# Altium schematic sheet 01. TABLE OF CONTENTS.SchDoc: TABLE OF CONTENTS
size 513 x 386 mm; Page Create Date: March  8, 1995; Variant Name: Core Design; Page Number: 1; Schematic Page Number: 1; Page Size: C; Comment: MISTRAL_TITLEBLK_CSIZE_1; Page Count: 62; Project: PROC154E2(001)_SK_AM69; Issue: 1.0; RevCode: E3; DsnPath: C:\Users\danie\Downloads\sprr466c\PROC154E3_RP\PROC154E3_SCH.DSN; SchematicName: SCHEMATIC1; PageName: 01. TABLE OF CONTENTS; PageSize: C; TopSchematic: True
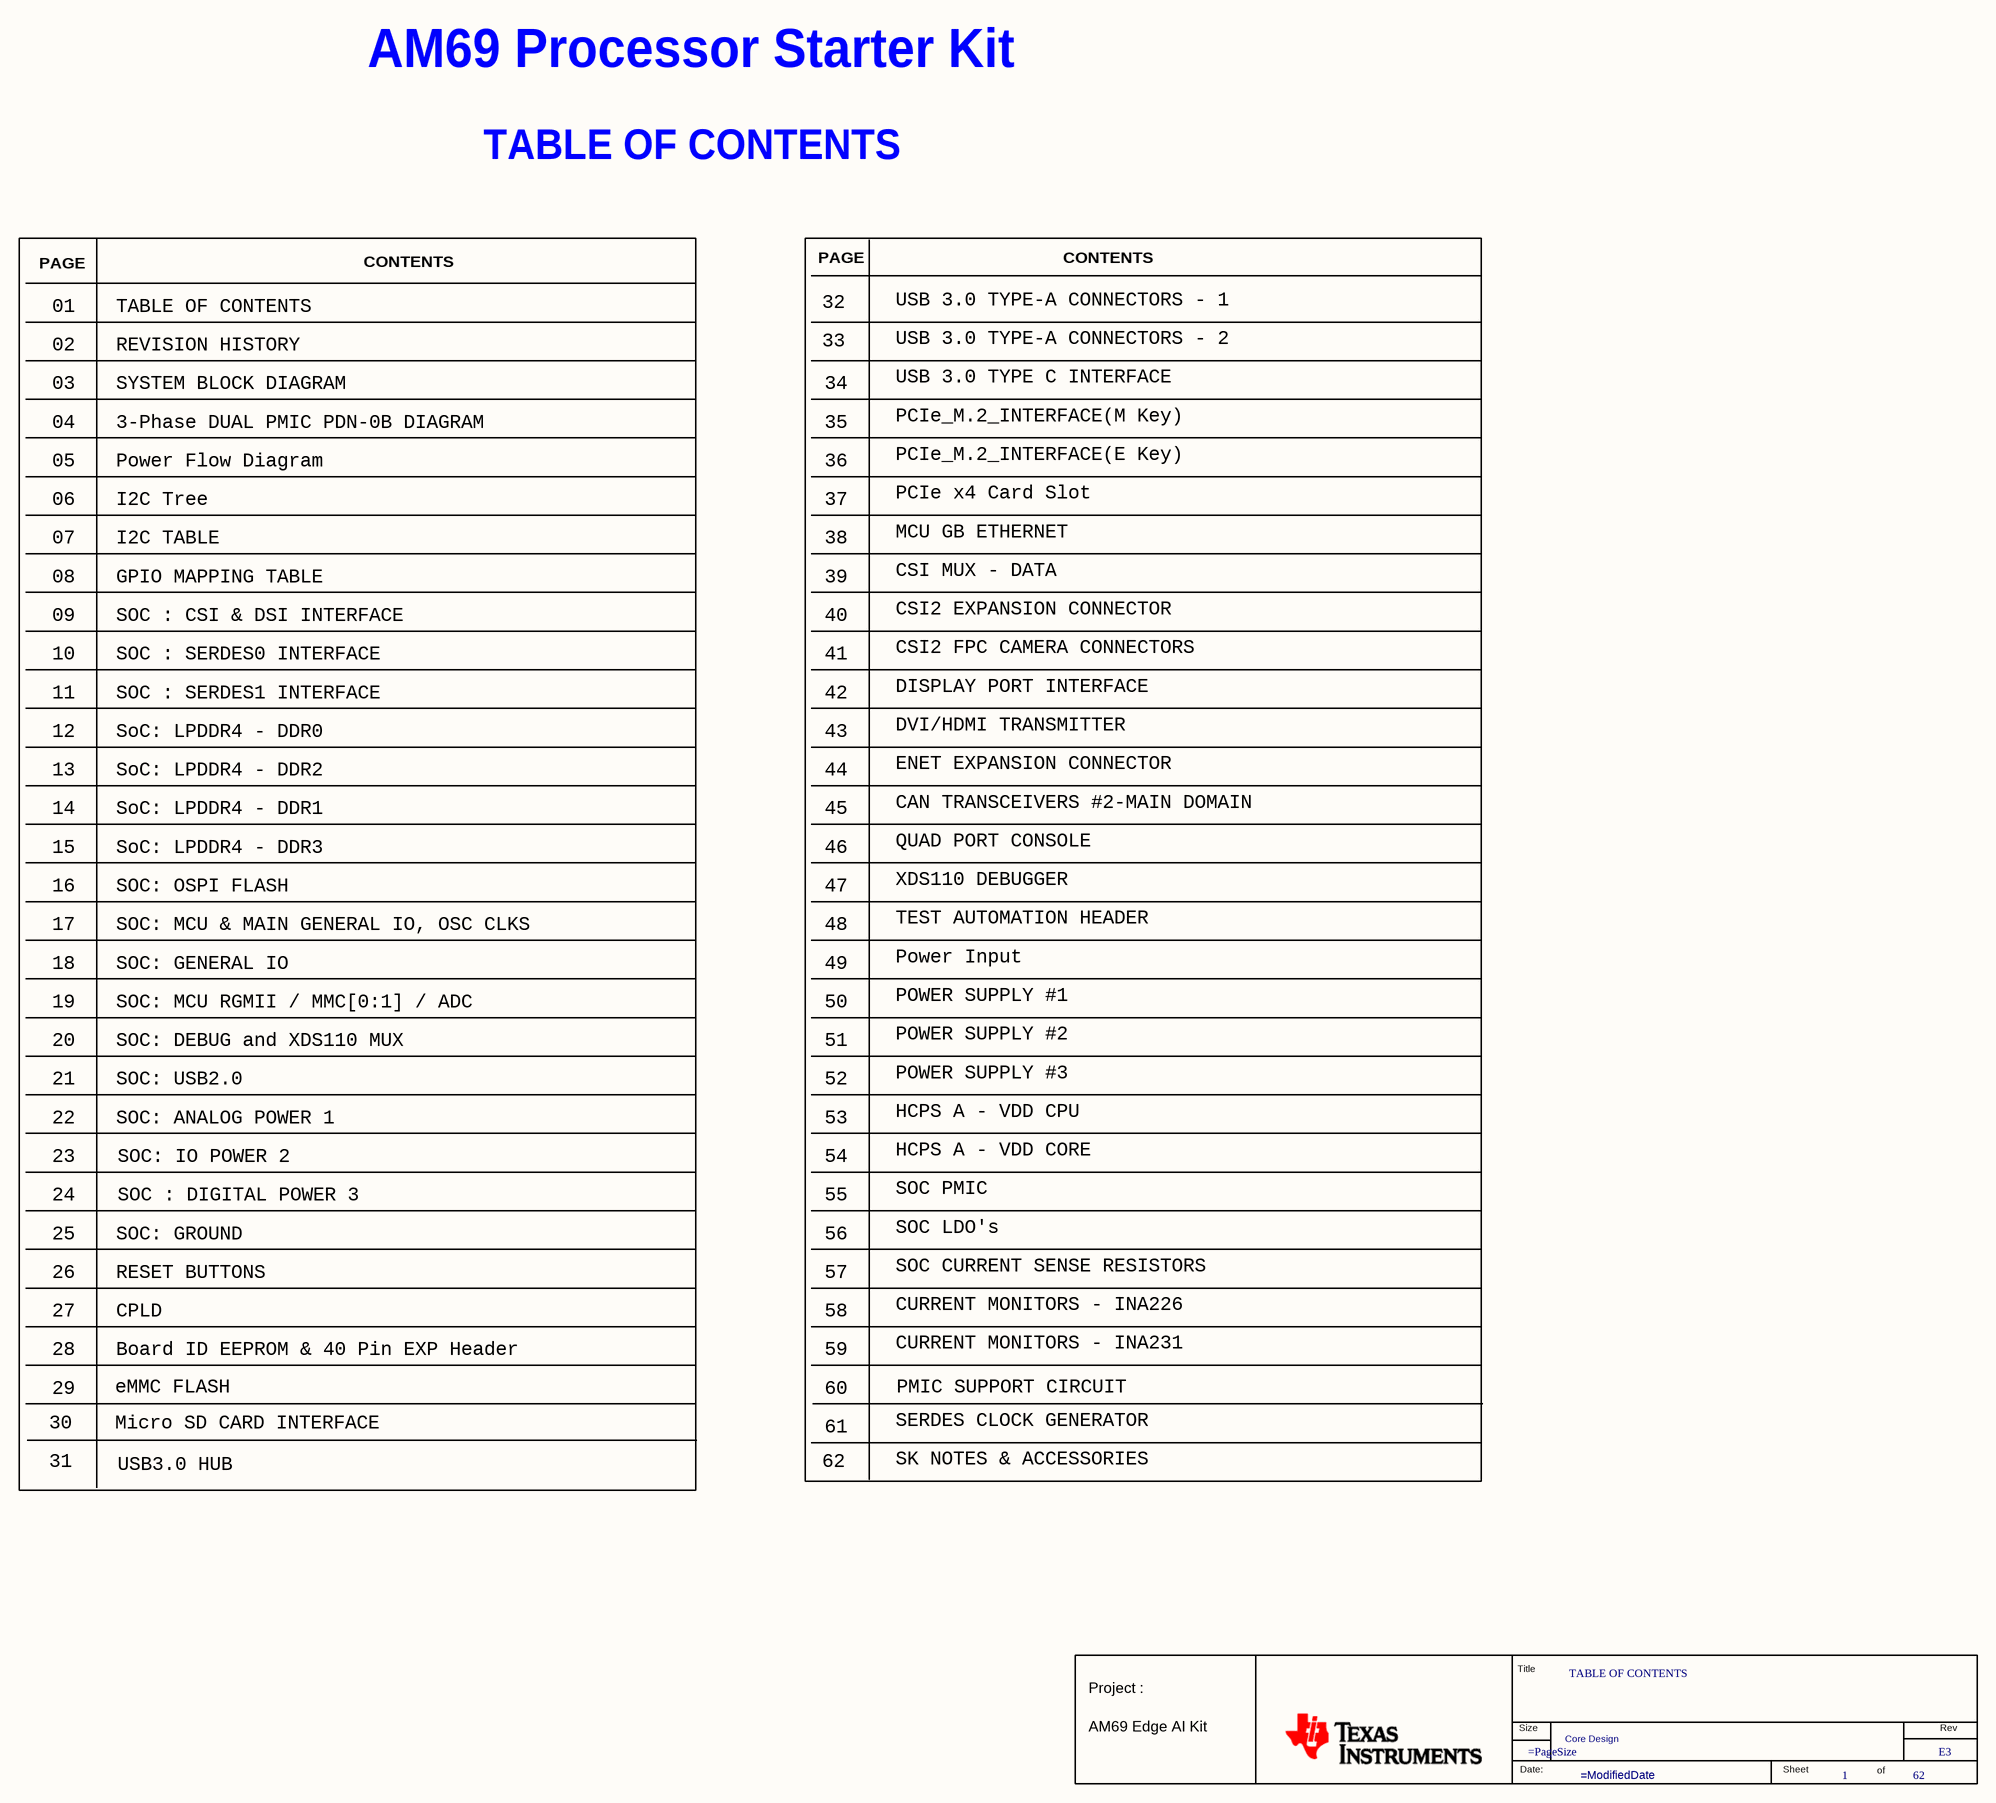
[diagram p0: 01. TABLE OF CONTENTS.SchDoc]

## Parts
*  RevCode: E3  Title: TABLE OF CONTENTS  Page Number: 1  Page Count: 62  Variant Name: Core Design  (hidden comment: MISTRAL_TITLEBLK_CSIZE_1)  (graphical)

## Notes on the sheet
- AM69 Processor Starter Kit
- TABLE OF CONTENTS
- PAGE
- CONTENTS
- 01
- 32
- USB 3.0 TYPE-A CONNECTORS - 1
- 02
- 03
- REVISION HISTORY
- SYSTEM BLOCK DIAGRAM
- 33
- 34
- USB 3.0 TYPE-A CONNECTORS - 2
- USB 3.0 TYPE C INTERFACE
- 04
- 05
- Power Flow Diagram
- 3-Phase DUAL PMIC PDN-0B DIAGRAM
- 35
- 36
- PCIe_M.2_INTERFACE(M Key)
- PCIe_M.2_INTERFACE(E Key)
- 06
- I2C Tree
- 37
- PCIe x4 Card Slot
- 07
- 08
- I2C TABLE
- GPIO MAPPING TABLE
- 38
- 39
- MCU GB ETHERNET
- CSI MUX - DATA
- 10
- 09
- SOC : CSI & DSI INTERFACE
- SOC : SERDES0 INTERFACE
- 40
- 41
- CSI2 EXPANSION CONNECTOR
- CSI2 FPC CAMERA CONNECTORS
- 11
- SOC : SERDES1 INTERFACE
- 42
- DISPLAY PORT INTERFACE
- 12
- 13
- SoC: LPDDR4 - DDR2
- SoC: LPDDR4 - DDR0
- 43
- 44
- DVI/HDMI TRANSMITTER
- ENET EXPANSION CONNECTOR
- 14
- 15
- SoC: LPDDR4 - DDR1
- SoC: LPDDR4 - DDR3
- 45
- 46
- CAN TRANSCEIVERS #2-MAIN DOMAIN
- QUAD PORT CONSOLE
- 16
- SOC: OSPI FLASH
- 47
- XDS110 DEBUGGER
- 17
- 18
- SOC: MCU & MAIN GENERAL IO, OSC CLKS
- SOC: GENERAL IO
- 48
- 49
- TEST AUTOMATION HEADER
- Power Input
- 19
- 20
- SOC: MCU RGMII / MMC[0:1] / ADC
- SOC: DEBUG and XDS110 MUX
- 50
- 51
- POWER SUPPLY #1
- POWER SUPPLY #2
- 21
- SOC: USB2.0
- 52
- POWER SUPPLY #3
- 22
- 23
- SOC: ANALOG POWER 1
- SOC: IO POWER 2
- 53
- 54
- HCPS A - VDD CPU
- HCPS A - VDD CORE
- 24
- 25
- SOC: GROUND
- SOC : DIGITAL POWER 3
- 55
- 56
- SOC PMIC
- SOC LDO's
- 26
- RESET BUTTONS
- 57
- SOC CURRENT SENSE RESISTORS
- 27
- 28
- CPLD
- Board ID EEPROM & 40 Pin EXP Header
- 58
- 59
- CURRENT MONITORS - INA226
- CURRENT MONITORS - INA231
- 30
- 29
- Micro SD CARD INTERFACE
- eMMC FLASH
- 60
- 61
- SERDES CLOCK GENERATOR
- PMIC SUPPORT CIRCUIT
- 31
- USB3.0 HUB
- 62
- SK NOTES & ACCESSORIES
- (in symbol MISTRAL_TITLEBLK_CSIZE_1) Title; Project :; Size; Rev; AM69 Edge AI Kit; Date:; Sheet; of

## Library data of the parts
* = MISTRAL_TITLEBLK_CSIZE_1: Issue: 1.0; Project: PROC154E2(001)_SK_AM69; Page Create Date: March  8, 1995; Page Size: =PageSize; Page Modify Date: =ModifiedDate; Schematic Page Number: 1